# EAGLE design fuse-b-1 (EAGLE 9.6.2)
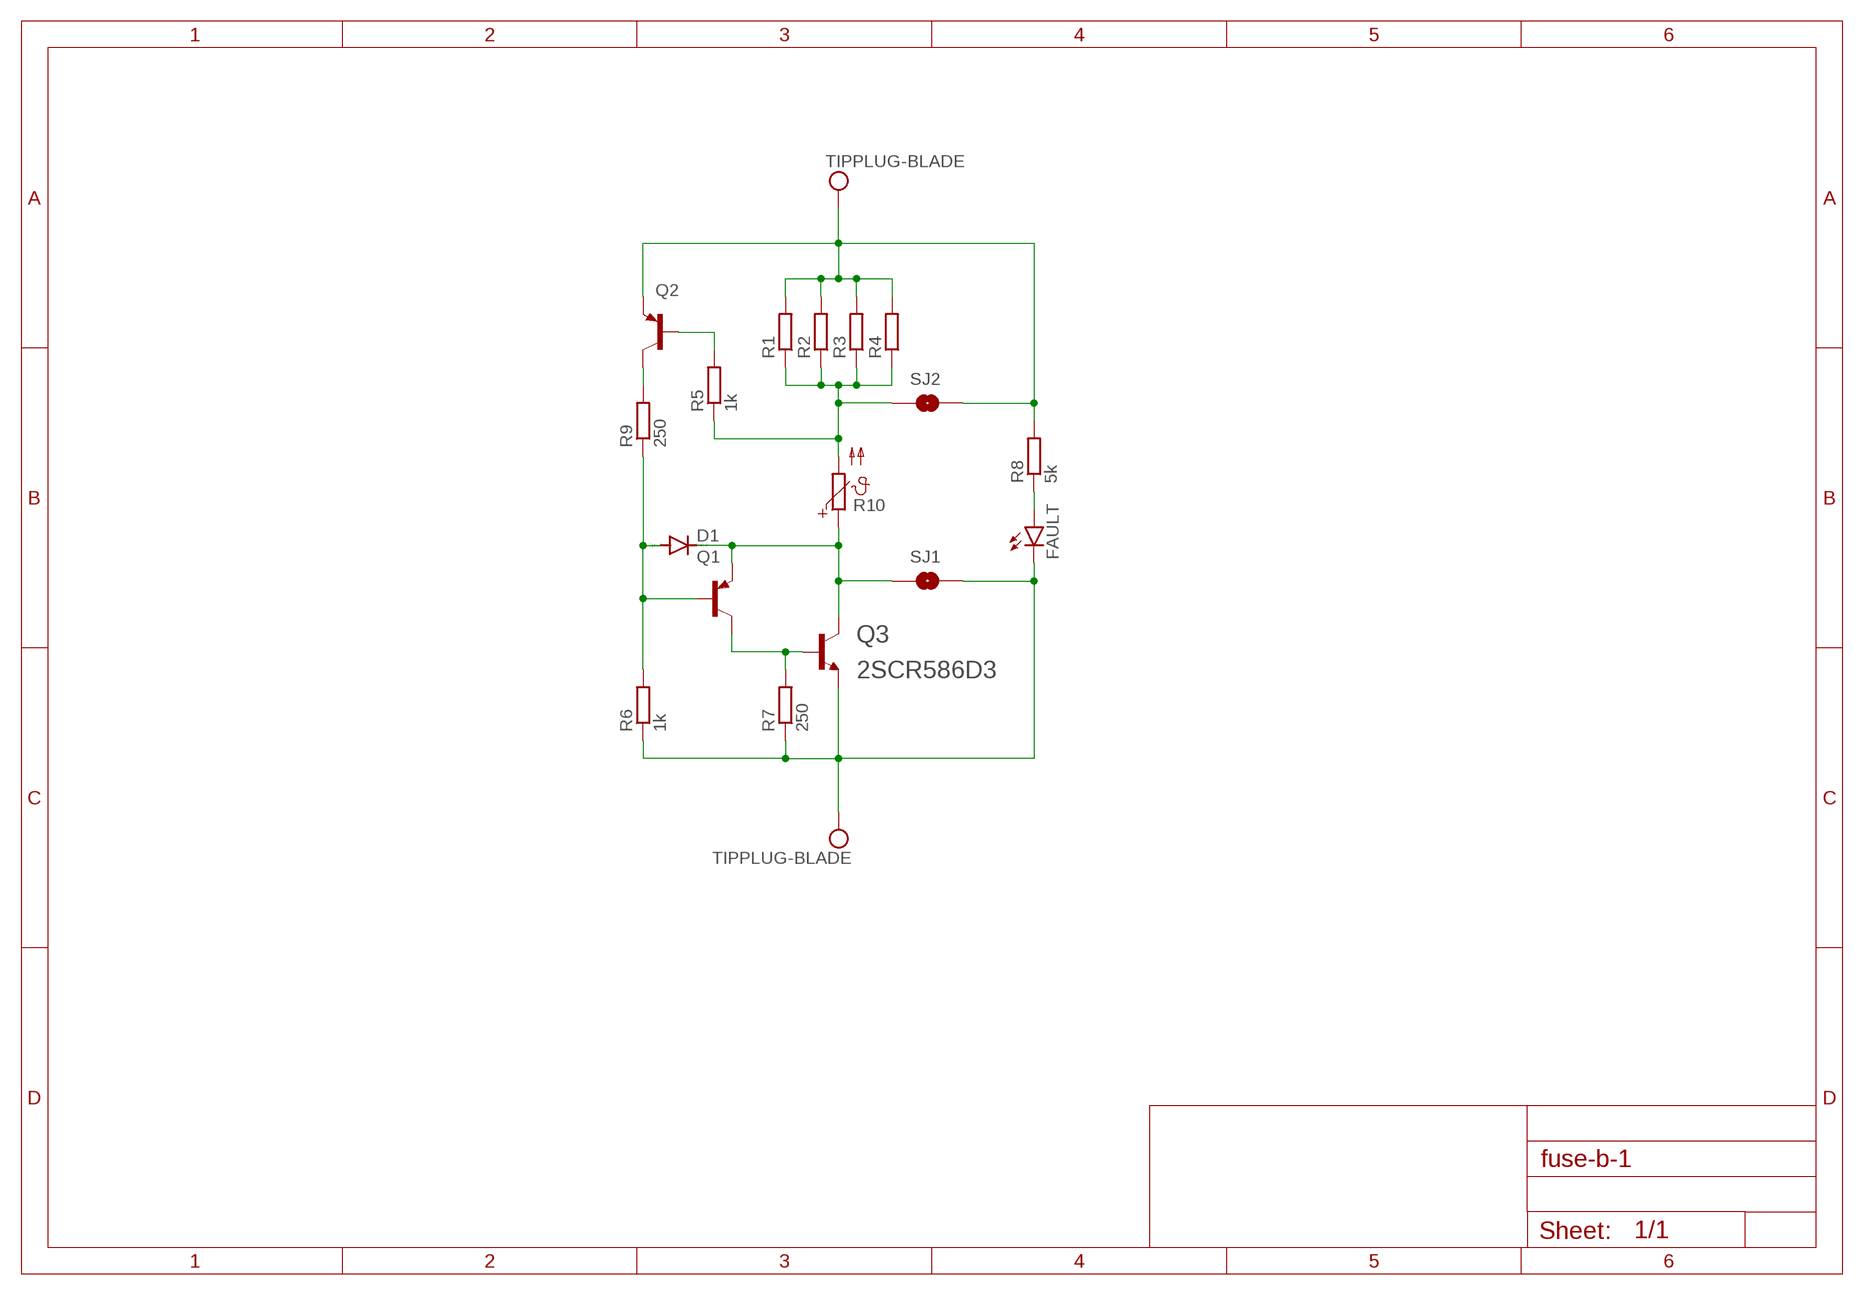
[diagram p0: schematic, sheet 1]

## Parts
D1  DIODE-MINIMELF  [MINIMELF]
FAULT  LEDCHIPLED_0603  [CHIPLED_0603]
Q1  BCX71SMD  [SOT23]
Q2  BCX71SMD  [SOT23]
Q3  2SCR586D3  2SCR586D3TL1  [D-PAK_TO252AA]
R1  R-EU_R2512  [R2512]
R2  R-EU_R2512  [R2512]
R3  R-EU_R2512  [R2512]
R4  R-EU_R2512  [R2512]
R5  1k  R-EU_R0805  [R0805]
R6  1k  R-EU_R0805  [R0805]
R7  250  R-EU_R0805  [R0805]
R8  5k  R-EU_R0805  [R0805]
R9  250  R-EU_R0805  [R0805]
R10  PTC_1812  [PTC1812]
SJ1  SJRND2  [SJ_RND2]
SJ2  SJRND2  [SJ_RND2]
U$1  TIPPLUG-BLADE  [BLADEPLUG-9.5X1.25]
U$2  TIPPLUG-BLADE  [BLADEPLUG-9.5X1.25]

## Nets
FUSEIN: R1.1 R2.1 R3.1 R4.1 R5.1 R10.2 SJ2.P$1
FUSEOUT: D1.C Q1.2(E) Q3.4(C) R10.1 SJ1.P$1
N$1: Q2.1(B) R5.2
N$4: D1.A Q1.1(B) R6.2 R9.1
N$5: Q1.3(C) Q3.1(B) R7.2
N$6: FAULT.A R8.1
N$8: Q2.3(C) R9.2
VIN: Q2.2(E) R1.2 R2.2 R3.2 R4.2 R8.2 SJ2.P$2 U$1.PB($1) U$1.PT($1)
VOUT: FAULT.C Q3.3(E) R6.1 R7.1 SJ1.P$2 U$2.PB($1) U$2.PT($1)

## Library data of the parts
D1 = diode:DIODE-: DIODE
FAULT = led:LED: LED OSRAM: - CHIPLED LG R971, LG N971, LY N971, LG Q971, LY Q971, LO R971, LY R971 LH N974, LH R974 LS Q976, LO Q976, LY Q976 LO Q996 - Hyper CHIPLED LW Q18S LB Q993, LB Q99A, LB R99A - SideLED LS A670, LO A670, LY A670, LG A670, LP A670 LB A673, LV A673, LT A673, LW A673 LH A674 LY A675 LS A676, LA A676, LO A676, LY A676, LW A676 LS A679, LY A679, LG A679 - Hyper Micro SIDELED® LS Y876, LA Y876, LO Y876, LY Y876 LT Y87S - SmartLED LW L88C, LW L88S LB L89C, LB L89S, LG L890 LS L89K, LO L89K, LY L89K LS L896, LA L896, LO L896, LY L896 - TOPLED LS T670, LO T670, LY T670, LG T670, LP T670 LSG T670, LSP T670, LSY T670, LOP T670, LYG T670 LG T671, LOG T671, LSG T671 LB T673, LV T673, LT T673, LW T673 LH T674 LS T676, LA T676, LO T676, LY T676, LB T676, LH T676, LSB T676, LW T676 LB T67C, LV T67C, LT T67C, LS T67K, LO T67K, LY T67K, LW E67C LS E67B, LA E67B, LO E67B, LY E67B, LB E67C, LV E67C, LT E67C LW T67C LS T679, LY T679, LG T679 LS T770, LO T770, LY T770, LG T770, LP T770 LB T773, LV T773, LT T773, LW T773 LH T774 LS E675, LA E675, LY E675, LS T675 LS T776, LA T776, LO T776, LY T776, LB T776 LHGB T686 LT T68C, LB T68C - Hyper Mini TOPLED® LB M676 - Mini TOPLED Santana® LG M470 LS M47K, LO M47K, LY M47K Source: http://www.osram.convergy.de LUXEON: - LUMILED® LXK2-PW12-R00, LXK2-PW12-S00, LXK2-PW14-U00, LXK2-PW14-V00 LXK2-PM12-R00, LXK2-PM12-S00, LXK2-PM14-U00 LXK2-PE12-Q00, LXK2-PE12-R00, LXK2-PE12-S00, LXK2-PE14-T00, LXK2-PE14-U00 LXK2-PB12-K00, LXK2-PB12-L00, LXK2-PB12-M00, LXK2-PB14-N00, LXK2-PB14-P00, LXK2-PB14-Q00 LXK2-PR12-L00, LXK2-PR12-M00, LXK2-PR14-Q00, LXK2-PR14-R00 LXK2-PD12-Q00, LXK2-PD12-R00, LXK2-PD12-S00 LXK2-PH12-R00, LXK2-PH12-S00 LXK2-PL12-P00, LXK2-PL12-Q00, LXK2-PL12-R00 Source: www.luxeon.com KINGBRIGHT: KA-3528ASYC Source: www.kingbright.com
Q1 Q2 = transistor-pnp:BCX71SMD: PNP Transistor
Q3 = eagleparts:2SCR586D3TL1
R1-R9 = rcl:R-EU_: RESISTOR, European symbol; SPICEPREFIX: R
R10 = tcs:PTC_: PHILIPS PTC
SJ1 SJ2 = eagleparts:SJ: SMD solder JUMPER
U$1 U$2 = eagleparts:TIPPLUG

## Board
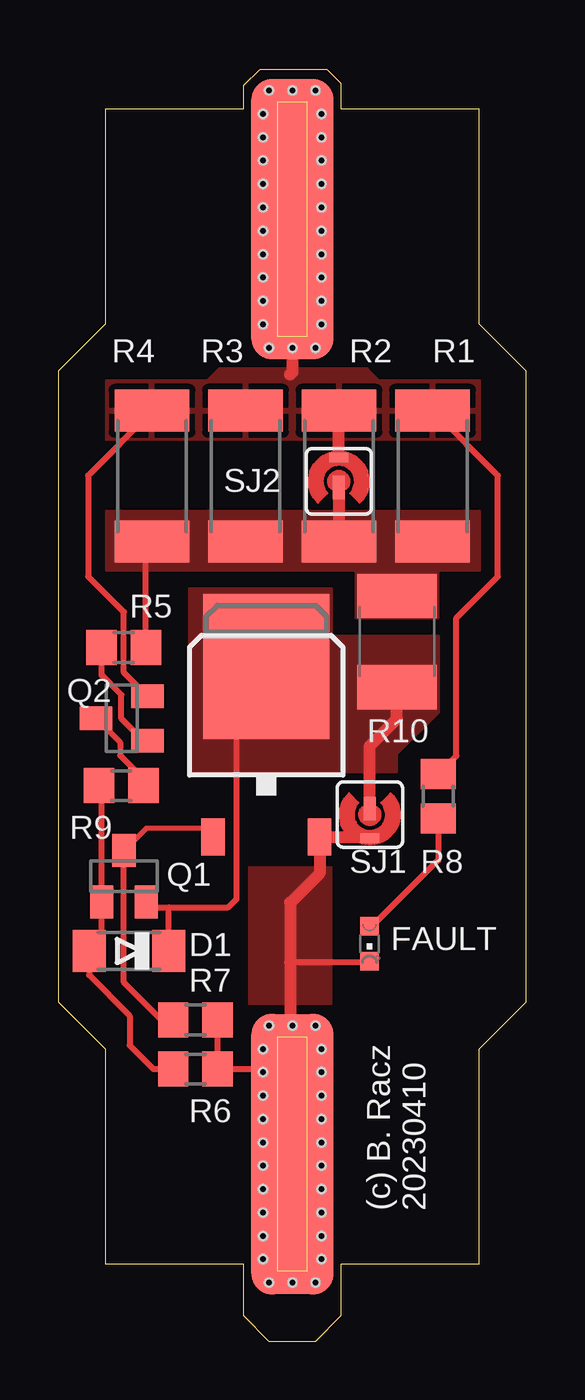
[diagram p1: board, top side]
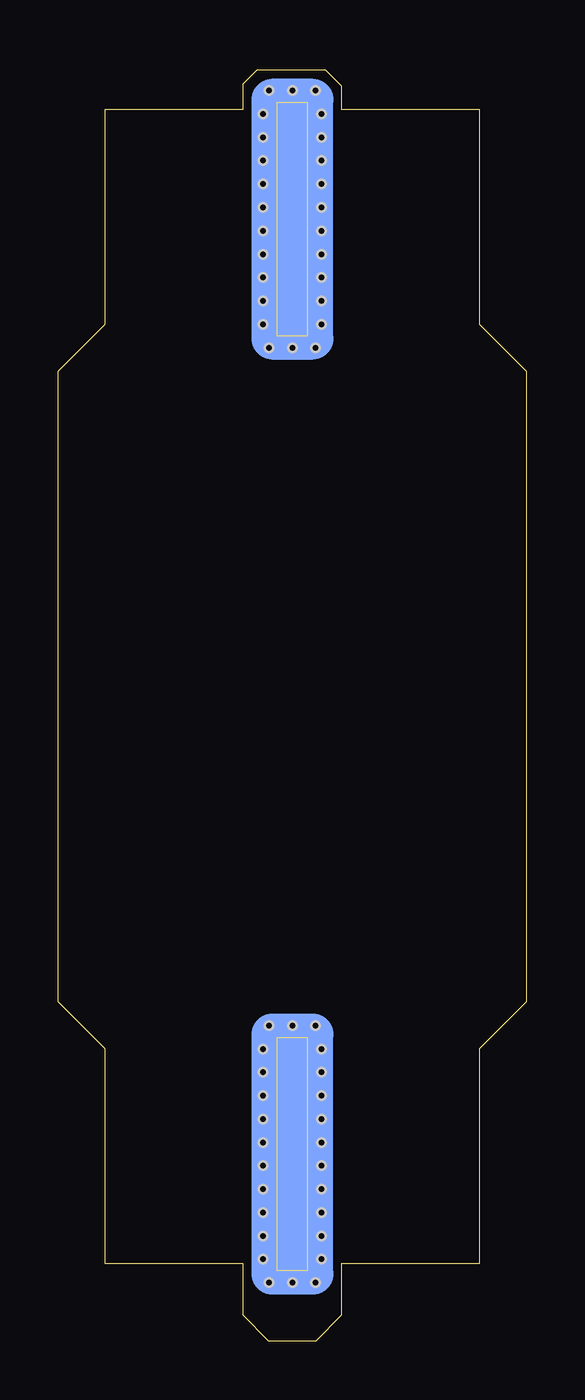
[diagram p2: board, bottom side, seen from below]

Size 20 x 54.4 mm. Coordinates in mm from the lower left corner, seen from the top.
Outline: 7.9,3.3 7.9,1.1 9,0 11,0 12.1,1.1 12.1,3.3 18,3.3 18,12.5 20,14.5 20,41.5 18,43.5 18,52.7 12.1,52.7 12.1,53.8 11.5,54.4 8.6,54.4 7.9,53.7 7.9,52.7 2,52.7 2,43.5 0,41.5 0,14.5 2,12.5 2,3.3 7.9,3.3
Copper layers (1*16): Top 0.035mm / dielectric 1.5mm / Bottom 0.035mm
Design rules "SeeedStudio_2layer_DRU_no_angle_20140221": minimum track width 6mil, minimum drill 12mil, track to track 6mil, track to pad 6mil, pad to pad 6mil, via to via 6mil, smd to smd 0mil, copper to edge 10mil, drill to drill 10mil, minimum pad ring 10mil, minimum via ring 6mil, stop-mask expansion 2mil, vias tented up to drill 100mil, thermal gap 10mil

### Footprints (pad centres in the part's own frame; a part is rotated, then mirrored left to right if it is on the bottom)
MINIMELF = smd 1.4 x 1.8: A 1.7,0; C -1.7,0
CHIPLED_0603 = smd 0.8 x 0.8: A 0,-0.75; C 0,0.75
SOT23 = smd 1 x 1.4: 1 -0.95,-1.1; 2 0.95,-1.1; 3 0,1.1
D-PAK_TO252AA = smd 1 x 1.6: 1 -2.28,-4.8; 3 2.28,-4.8 | smd 5.4 x 6.2: 4 0,2.5
R2512 = smd 1.8 x 3.2: 1 -2.8,0; 2 2.8,0
R0805 = smd 1.3 x 1.5: 1 -0.95,0; 2 0.95,0
PTC1812 = smd 1.9 x 3.4: 1 -1.95,0; 2 1.95,0
SJ_RND2 = smd 1.016 x 0.508: P$1 -0.254,0 | smd 0.406 x 0.813: P$2 1.016,0
BLADEPLUG-9.5X1.25 = smd 12 x 3.5 bottom: PB 0,0 | smd 12 x 3.5: PT 0,0 | hole 0.35: -4.5,1.25; -3.5,1.25; -2.5,1.25; -1.5,1.25; -0.5,1.25; 0.5,1.25; 1.5,1.25; 2.5,1.25; 3.5,1.25; 4.5,1.25; -4.5,-1.25; -3.5,-1.25; -2.5,-1.25; -1.5,-1.25; -0.5,-1.25; 0.5,-1.25; 1.5,-1.25; 2.5,-1.25; 3.5,-1.25; 4.5,-1.25; -5.5,1; -5.5,0; -5.5,-1; 5.5,1; 5.5,0; 5.5,-1

### Placement (x,y rotation side)
D1  3.01,16.69 180 top
FAULT  13.3,17 180 top
Q1  2.8,19.89 0 top
Q2  2.7,26.64 90 top
Q3  8.89,26.37 0 top
R1  16,37 90 top
R2  12,37 90 top
R3  8,37 90 top
R4  4,37 90 top
R5  2.79,29.67 180 top
R6  5.86,11.64 180 top
R7  5.86,13.74 180 top
R8  16.25,23.31 90 top
R9  2.69,23.76 0 top
R10  14.48,29.92 90 top
SJ1  13.32,22.52 270 top
SJ2  11.99,36.78 90 top
U$1  10,48 270 bottom
U$2  10,8 90 bottom

### Tracks (layer width: path | path; a pad name or v marks a point on that pad's centre or on a via)
FUSEIN
  Top 0.254: 2.67,34.2 3.81,34.2 | 3.81,34.2 R4.1 | R5.1 3.74,34.13 3.81,34.2
  Top 0.508: 15.96,34.24 R1.1 | SJ2.P$1 R2.1
  pour Top (no thermals): 18.03,32.97 18.03,35.51 2.03,35.51 2.03,32.97 12.7,32.97 12.7,30.94 16.26,30.94 16.26,32.97
FUSEOUT
  Top 0.254: Q1.2 3.99,18.55 4.72,18.55 | 4.72,18.55 7.26,18.55 7.62,18.91 7.62,27.6 Q3.4 | D1.C 4.71,18.54 4.72,18.55
  Top 0.406: R10.1 14.48,26.92
  Top 0.508: SJ1.P$1 13.32,25.46 14.48,26.62 R10.1
  pour Top (no thermals): 5.59,32.21 11.68,32.21 11.68,30.18 16.26,30.18 16.26,26.88 14.48,25.1 14.48,24.34 5.59,24.34
N$1
  Top 0.254: Q2.1 3.63,25.69 2.69,26.63 2.69,27.65 1.84,28.49 R5.2
N$4
  Top 0.254: R9.1 1.85,23.65 Q1.1 1.85,17.46 1.31,16.92 D1.A 1.31,15.66 3.05,13.92 3.05,12.65 4.06,11.64 R6.2
N$5
  Top 0.203: 6.61,21.93 3.75,21.93 Q1.3
  Top 0.254: Q1.3 2.79,20.98 2.79,15.35 4.4,13.74 R7.2 | Q3.1 6.61,21.93
N$6
  Top 0.254: R8.1 16.25,20.58 13.42,17.75 FAULT.A
N$8
  Top 0.254: Q2.3 2.64,25.6 2.64,25.05 3.3,24.39 3.35,24.39 3.64,24.11 R9.2
VIN
  Top 0.254: Q2.2 2.79,28.6 2.79,31.19 1.27,32.72 1.27,37.04 4,39.77 R4.2 | R8.2 17.02,25.03 17.02,30.94 18.8,32.72 18.8,37.04 16.03,39.8 R1.2
  Top 0.508: SJ2.P$2 R2.2 | U$1.PT 10,41.45 9.91,41.35
  pour Top: 2.03,38.56 18.03,38.56 18.03,41.1 13.72,41.1 13.21,41.61 6.86,41.61 6.35,41.1 2.03,41.1
VOUT
  Top 0.254: R7.1 R6.1 9.9,11.64 9.91,11.64 | FAULT.C 13.26,16.21 9.91,16.21 | U$2.PT 9.91,8.09 9.91,9.6
  Top 0.406: 13.3,21.52 SJ1.P$2
  Top 0.508: SJ1.P$2 13.26,21.57 Q3.3 11.17,20.01 9.91,18.75 9.91,16.21 9.91,11.64 9.91,9.6
  pour Top: 8.13,14.43 11.68,14.43 11.68,20.27 8.13,20.27

### Text on the board
tNames: (c) B. Racz / 20230410